# EAGLE board SOM EVAL BOARD V100 (EAGLE 9.4.1), part 1 of 3
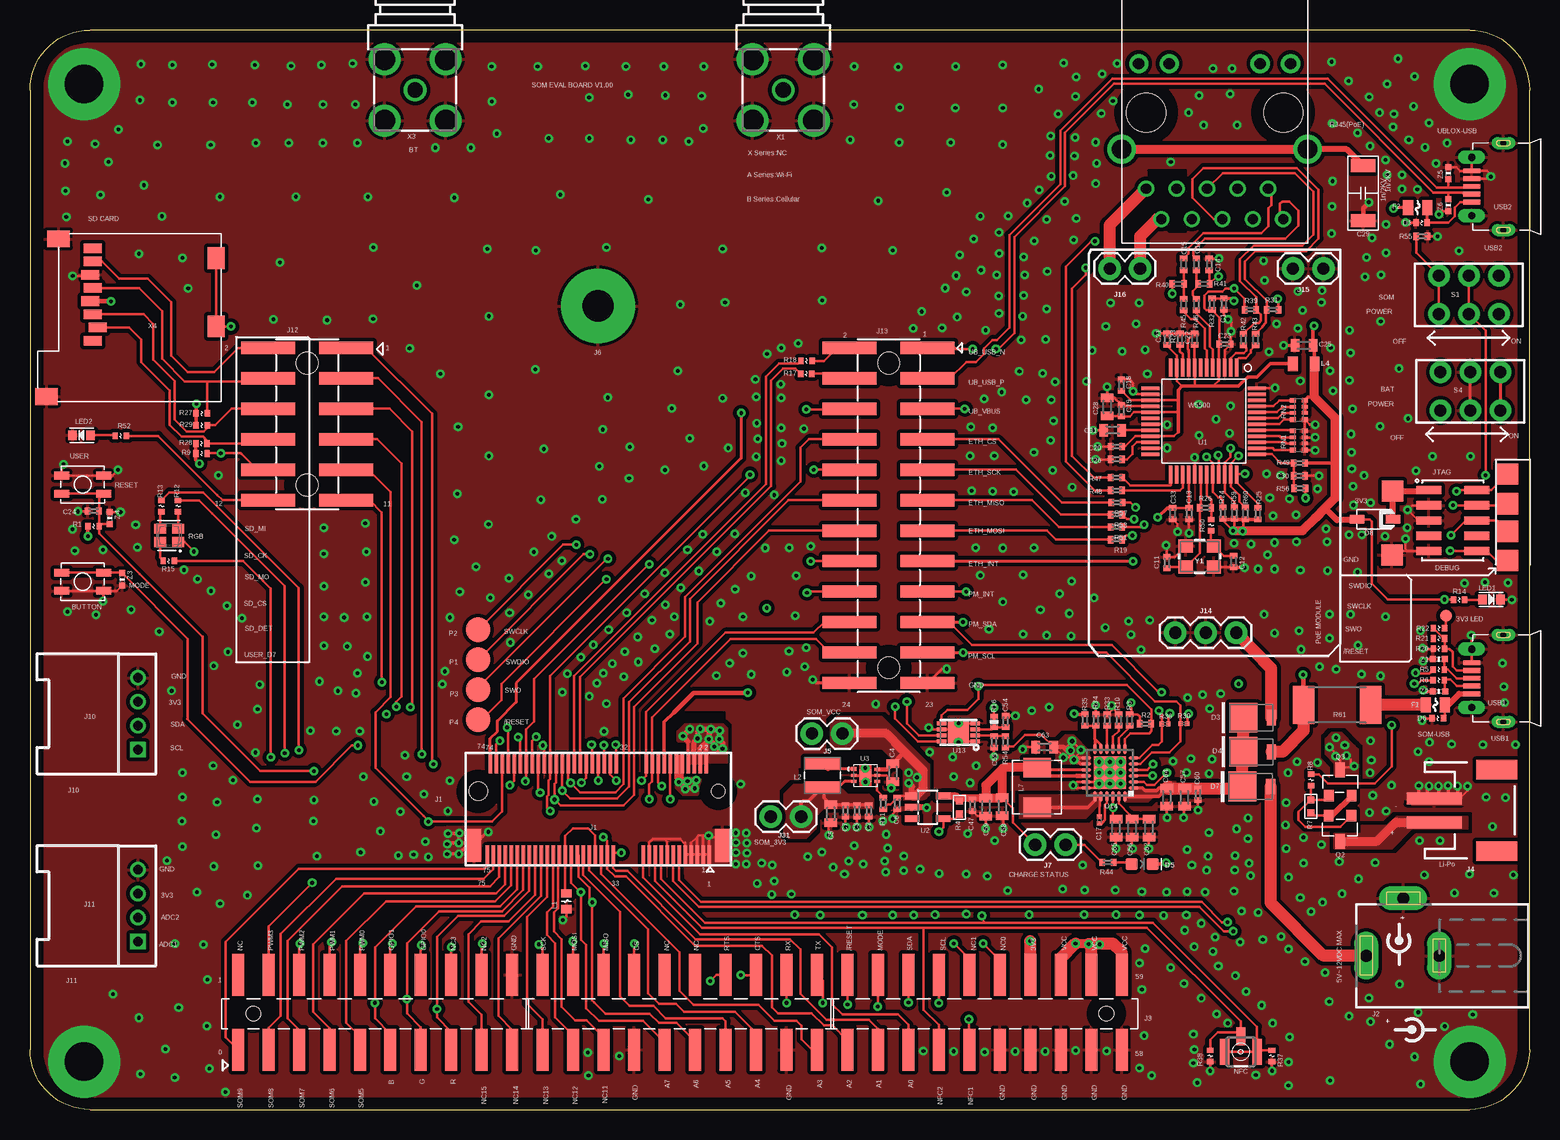
[diagram p3: board, top side]
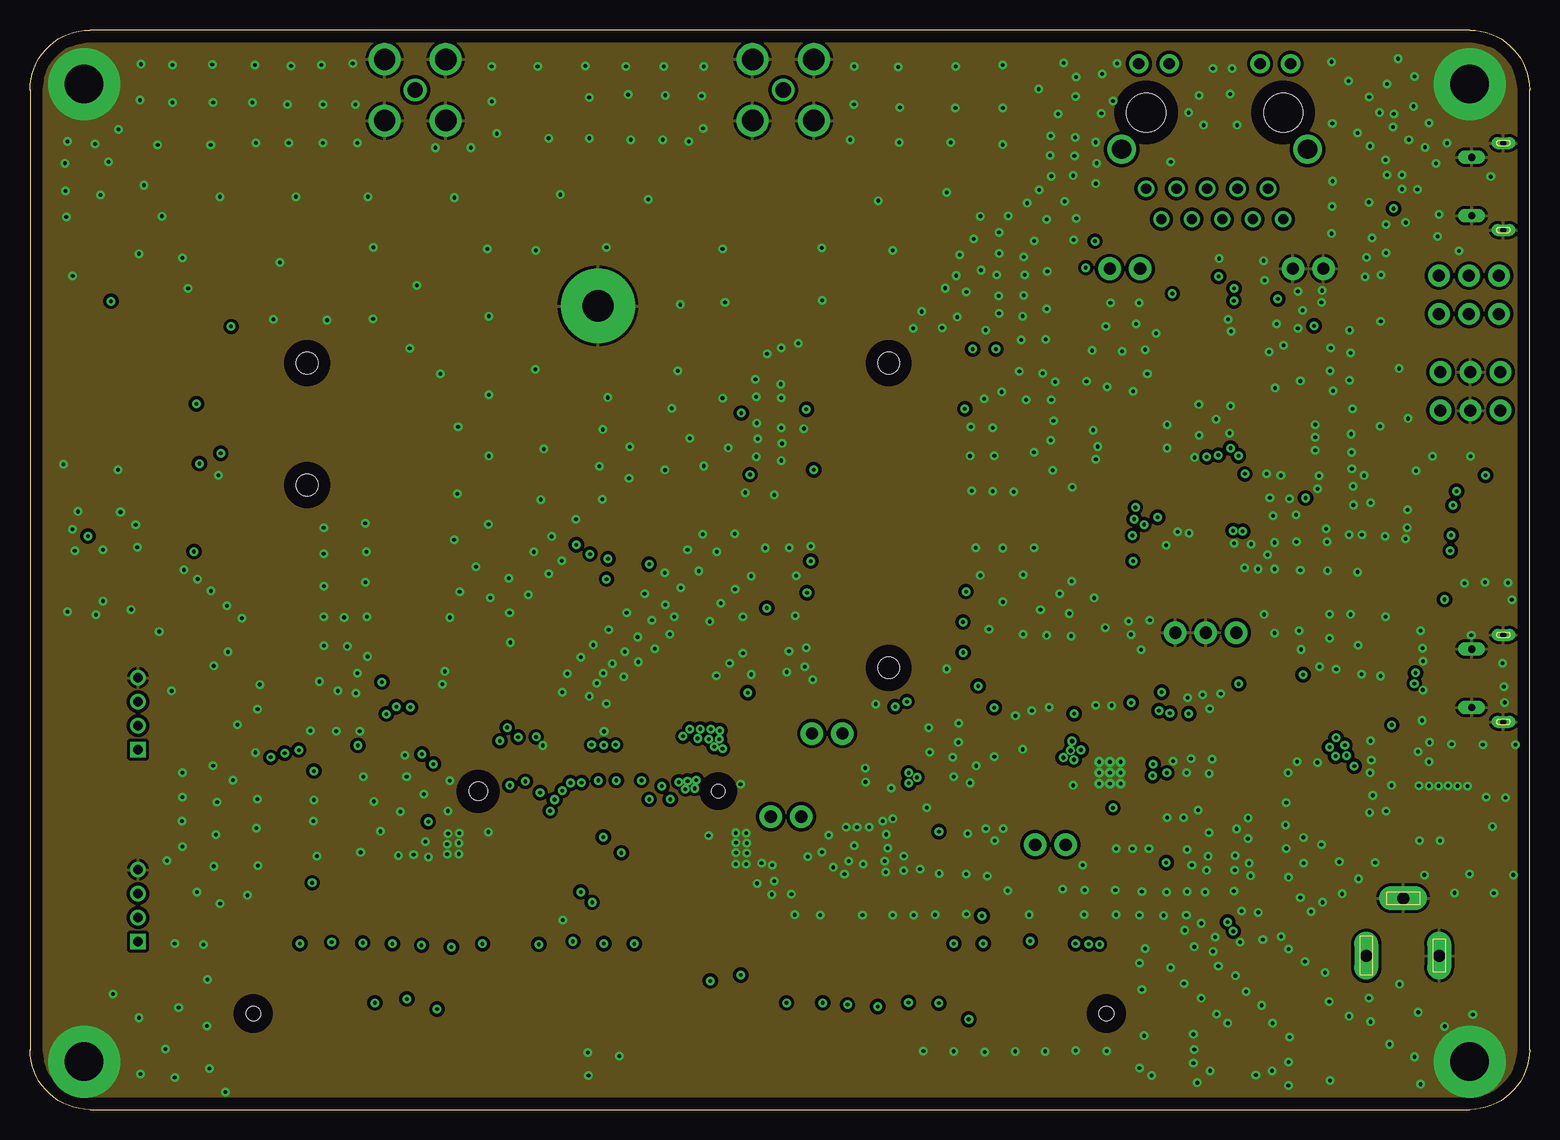
[diagram p4: board, inner layer Route2]
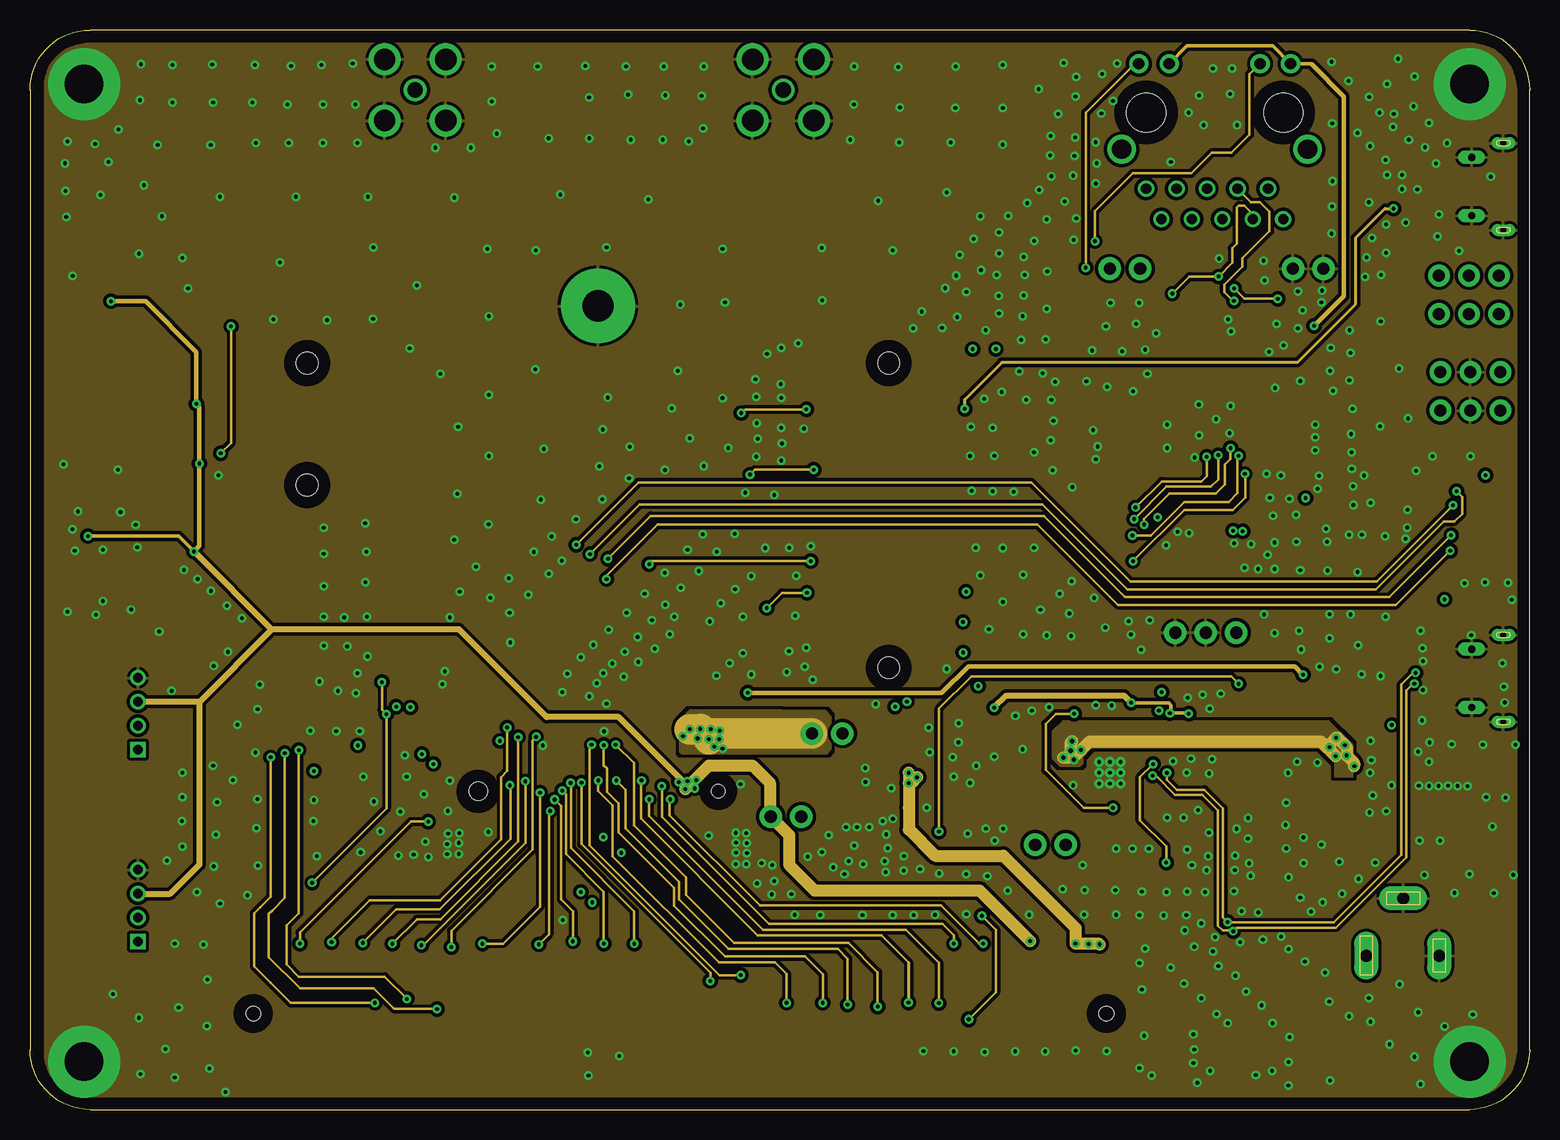
[diagram p5: board, inner layer Route15]
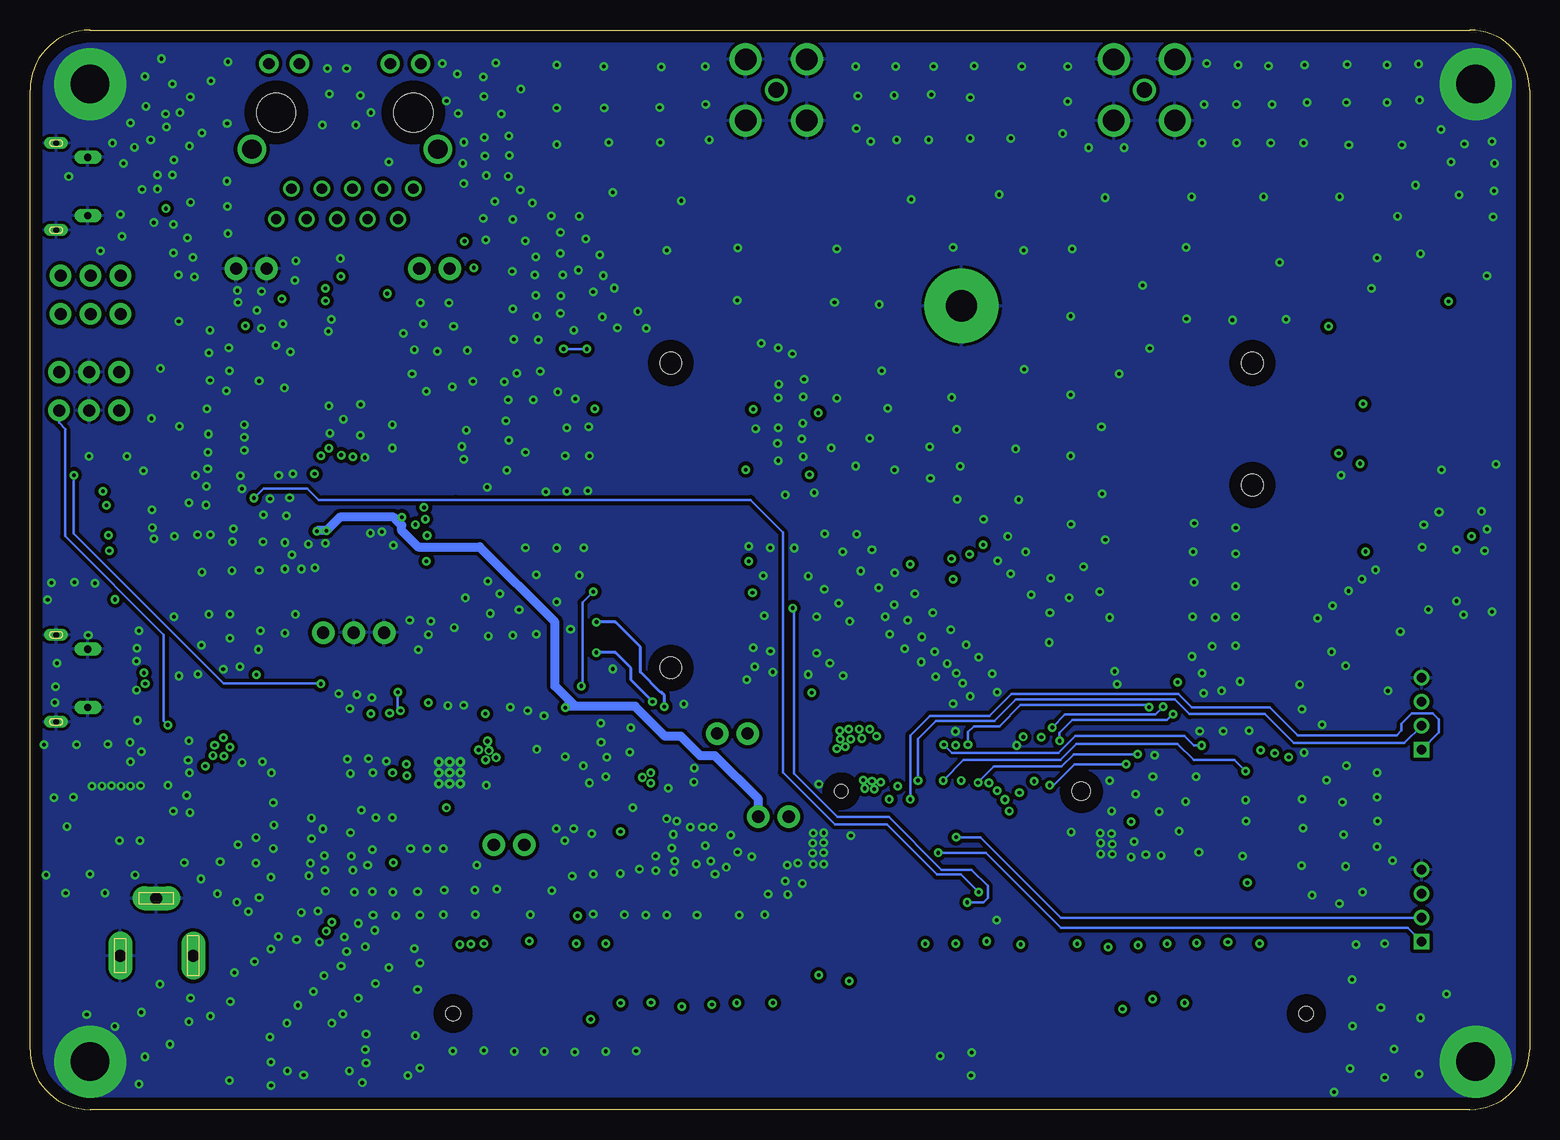
[diagram p6: board, bottom side, seen from below]

Size 125 x 90 mm. Coordinates in mm from the lower left corner, seen from the top.
Outline: 5,0 120,0 arc90 125,5 125,85 arc90 120,90 5,90 arc90 0,85 0,5 arc90 5,0
Copper layers (1+2*15+16): Top 0.035mm / dielectric 1.5mm / Route2 0.035mm / dielectric 0.15mm / Route15 0.035mm / dielectric 0.2mm / Bottom 0.035mm
Design rules "default *": minimum track width 8mil, minimum drill 12mil, track to track 8mil, track to pad 6mil, pad to pad 6mil, via to via 6mil, smd to smd 6mil, copper to edge 40mil, drill to drill 6mil, minimum pad ring 10mil, minimum via ring 8mil, stop-mask expansion 4mil, vias tented up to drill 20mil, thermal gap 10mil
Net classes: 0 default: width 0.152 mm, clearance 0.152 mm; 1 power: width 0.254 mm, drill 0.61 mm, clearance 0.203 mm; 3 BAT: clearance 0.203 mm; 4 3V3: width 0.305 mm, clearance 0.508 mm; 6 +3V3: width 0.203 mm, clearance 0.152 mm

## Footprints (pad centres in the part's own frame; a part is rotated, then mirrored left to right if it is on the bottom)
TS-1185A-020 = smd 1.27 x 0.635: 1 -1.75,0.752; 2 1.75,0.752; 3 -1.75,-0.752; 4 1.75,-0.752
C0402_B = smd 0.457 x 0.61: 1 -0.483,0; 2 0.483,0
C0603_B = smd 0.711 x 1.041: 1 -0.749,0; 2 0.749,0
C0201_B = smd 0.356 x 0.406: 1 -0.279,0; 2 0.279,0
C-1808 = smd 1.1 x 2.05: P$1 -2.285,0; P$2 2.285,0
R-0402S = smd 0.45 x 0.55: 1 -0.47,0; 2 0.47,0
DIODE-DO-220AA_NT(SMP) = smd 0.762 x 1.27: ANODE 2.349,0 | smd 2.337 x 2.464: CATHODE 0,0
LED-0603 = smd 1 x 1: A -0.877,0; C 0.877,0
SOD-123 = smd 1.2 x 0.7: 1 -1.5,0; 2 1.5,0
CON5X2_1.27 = smd 0.7 x 2.1: 1 -2.54,-2; 2 -2.54,2; 3 -1.27,-2; 4 -1.27,2; 5 0,-2; 6 0,2; 7 1.27,-2; 8 1.27,2; 9 2.54,-2; 10 2.54,2
F0805 = smd 0.85 x 1.25: P$1 -0.8,0; P$2 0.8,0
M.2EKEY = smd 0.3 x 1.55: 1 -9.62,3.735; 2 -9.37,-3.815; 3 -9.12,3.735; 4 -8.87,-3.815; 5 -8.62,3.735; 6 -8.37,-3.815; 7 -8.12,3.735; 8 -7.87,-3.815; 9 -7.62,3.735; 10 -7.37,-3.815; 11 -7.12,3.735; 12 -6.87,-3.815; 13 -6.62,3.735; 14 -6.37,-3.815; 15 -6.12,3.735; 16 -5.87,-3.815; 17 -5.62,3.735; 18 -5.37,-3.815; 19 -5.12,3.735; 20 -4.87,-3.815; 21 -4.62,3.735; 22 -4.37,-3.815; 23 -4.12,3.735; 32 -1.87,-3.815; 33 -1.62,3.735; 34 -1.37,-3.815; 35 -1.12,3.735; 36 -0.87,-3.815; 37 -0.62,3.735; 38 -0.37,-3.815; 39 -0.12,3.735; 40 0.13,-3.815; 41 0.38,3.735; 42 0.63,-3.815; 43 0.88,3.735; 44 1.13,-3.815; 45 1.38,3.735; 46 1.63,-3.815; 47 1.88,3.735; 48 2.13,-3.815; 49 2.38,3.735; 50 2.63,-3.815; 51 2.88,3.735; 52 3.13,-3.815; 53 3.38,3.735; 54 3.63,-3.815; 55 3.88,3.735; 56 4.13,-3.815; 57 4.38,3.735; 58 4.63,-3.815; 59 4.88,3.735; 60 5.13,-3.815; 61 5.38,3.735; 62 5.63,-3.815; 63 5.88,3.735; 64 6.13,-3.815; 65 6.38,3.735; 66 6.63,-3.815; 67 6.88,3.735; 68 7.13,-3.815; 69 7.38,3.735; 70 7.63,-3.815; 71 7.88,3.735; 72 8.13,-3.815; 73 8.38,3.735; 74 8.63,-3.815; 75 8.88,3.735 | smd 1.2 x 2.75: 76 9.98,2.96; 77 -10.72,2.96 | hole 1.1: -10.37,-1.54 | hole 1.55: 9.63,-1.54
DCJ0202 = drill 1 pad 2 long: 1 0,3.1; 2 4.8,0; 3 0,-3
SPARK_CON_30X2_SMD = smd 1 x 3.5: 1 0,3.013; 2 0,-3.213; 3 2.54,3.013; 4 2.54,-3.213; 5 5.08,3.013; 6 5.08,-3.213; 7 7.62,3.013; 8 7.62,-3.213; 9 10.16,3.013; 10 10.16,-3.213; 11 12.7,3.013; 12 12.7,-3.213; 13 15.24,3.013; 14 15.24,-3.213; 15 17.78,3.013; 16 17.78,-3.213; 17 20.32,3.013; 18 20.32,-3.213; 19 22.86,3.013; 20 22.86,-3.213; 21 25.4,3.013; 22 25.4,-3.213; 23 27.94,3.013; 24 27.94,-3.213; 25 30.48,3.013; 26 30.48,-3.213; 27 33.02,3.013; 28 33.02,-3.213; 29 35.56,3.013; 30 35.56,-3.213; 31 38.1,3.013; 32 38.1,-3.213; 33 40.64,3.013; 34 40.64,-3.213; 35 43.18,3.013; 36 43.18,-3.213; 37 45.72,3.013; 38 45.72,-3.213; 39 48.26,3.013; 40 48.26,-3.213; 41 50.8,3.013; 42 50.8,-3.213; 43 53.34,3.013; 44 53.34,-3.213; 45 55.88,3.013; 46 55.88,-3.213; 47 58.42,3.013; 48 58.42,-3.213; 49 60.96,3.013; 50 60.96,-3.213; 51 63.5,3.013; 52 63.5,-3.213; 53 66.04,3.013; 54 66.04,-3.213; 55 68.58,3.013; 56 68.58,-3.213; 57 71.12,3.013; 58 71.12,-3.213; 59 73.66,3.013; 60 73.66,-3.213 | hole 1.2: 1.27,0; 72.39,0
JST-2-SMD = smd 1 x 4.6: 1 -1,-3.7; 2 1,-3.7 | smd 1.6 x 3.4: NC1 -3.4,1.5; NC2 3.4,1.5
1X02 = drill 1.016 pad 1.88: 1 0,0; 2 2.54,0
SCREW-HOLE-2.6 = drill 2.6 pad 6.2: P$1 0,0
HW4-2.0-90D = drill 0.8 pad 1.27 square: 1 -3,0 | drill 0.8 pad 1.27: 2 -1,0; 3 1,0; 4 3,0
CON_6*2_SMD_HEADER = smd 1.02 x 4.5: 1 0,0.65; 2 0,-5.85; 3 2.54,0.65; 4 2.54,-5.85; 5 5.08,0.65; 6 5.08,-5.85; 7 7.62,0.65; 8 7.62,-5.85; 9 10.16,0.65; 10 10.16,-5.85; 11 12.7,0.65; 12 12.7,-5.85 | hole 1.8: 1.27,-2.6; 11.43,-2.6
1X03 = drill 1.016 pad 1.88: 1 0,0; 2 2.54,0; 3 5.08,0
CON_12*2_SMD_HEADER = smd 1.02 x 4.5: 1 0,0.65; 2 0,-5.85; 3 2.54,0.65; 4 2.54,-5.85; 5 5.08,0.65; 6 5.08,-5.85; 7 7.62,0.65; 8 7.62,-5.85; 9 10.16,0.65; 10 10.16,-5.85; 11 12.7,0.65; 12 12.7,-5.85; 13 15.24,0.65; 14 15.24,-5.85; 15 17.78,0.65; 16 17.78,-5.85; 17 20.32,0.65; 18 20.32,-5.85; 19 22.86,0.65; 20 22.86,-5.85; 21 25.4,0.65; 22 25.4,-5.85; 23 27.94,0.65; 24 27.94,-5.85 | hole 1.8: 1.27,-2.6; 26.67,-2.6
R-0603A = smd 0.7 x 0.85: 1 -0.65,0; 2 0.65,0
INDUCTOR-VLS-E = smd 1 x 3: P$1 -1,0; P$2 1,0
0805 = smd 0.8 x 1.2: 1 -0.9,0; 2 0.9,0
INDUCTOR-4040 = smd 1.65 x 2.3: P$1 -1.65,0; P$2 1.65,0
LED0603 = smd 0.7 x 0.8: 1 -0.75,0; 2 0.75,0
IPEX-20279-001E = smd 0.73 x 1.5: 1 0,1.28 | smd 0.8 x 2.2: 2@1 -1.35,0; 2@2 1.35,0
SPARK_POGO-2.0 = smd 2.032 x 2.032: P$2 0,0
SOT-23 = smd 0.8 x 0.95: 1 -0.95,-1; 2 0.95,-1 | smd 0.8 x 1.25: 3 0,1.15
R0402_B = smd 0.457 x 0.61: 1 -0.483,0; 2 0.483,0
R0603 = smd 0.6 x 0.6: 1 -0.55,0; 2 0.55,0
0402-RES = smd 0.55 x 0.6: 1 -0.4,0; 2 0.4,0
R2512 = smd 1.8 x 3.2: 1 -2.8,0; 2 2.8,0
PLCC4-2MM-RGB = smd 1 x 0.8: BLUE -0.75,-0.55; CA 0.75,-0.55; GREEN -0.75,0.55; RED 0.75,0.55
ARDUINO-ETHERNET-SHIELD2-V2_CONNETTORI_POE-RJ45 = drill 0.95 pad 1.6: 11 6.81,6.325; 12 6.81,3.785; 13 6.81,-3.785; 14 6.81,-6.325 | drill 1.6: CH1 13.94,7.75; CH2 13.94,-7.75 | drill 0.85 pad 1.3: R1 19.77,5.715; R2 17.23,4.445; R3 19.77,3.175; R4 17.23,1.905; R5 19.77,0.635; R6 17.23,-0.635; R7 19.77,-1.905; R8 17.23,-3.175; R9 19.77,-4.445; R10 17.23,-5.715 | hole 3.25: 10.89,5.715; 10.89,-5.715
4X0402ARV341 = smd 0.4 x 0.5: 1 -0.8,-0.5; 4 0.8,-0.5; 5 0.8,0.5; 8 -0.8,0.5 | smd 0.3 x 0.5: 2 -0.25,-0.5; 3 0.25,-0.5; 6 0.25,0.5; 7 -0.25,0.5
SWITCH-2.5X3.2-6 = drill 1 pad 1.8: 1 0,0; 2 0,2.5; 3 0,5; 4 3.2,0; 5 3.2,2.5; 6 3.2,5
TP = smd 1 x 1: P$1 0,0
W5500 = smd 1.5 x 0.3: 1 -4.45,2.75; 2 -4.45,2.25; 3 -4.45,1.75; 4 -4.45,1.25; 5 -4.45,0.75; 6 -4.45,0.25; 7 -4.45,-0.25; 8 -4.45,-0.75; 9 -4.45,-1.25; 10 -4.45,-1.75; 11 -4.45,-2.25; 12 -4.45,-2.75; 25 4.45,-2.75; 26 4.45,-2.25; 27 4.45,-1.75; 28 4.45,-1.25; 29 4.45,-0.75; 30 4.45,-0.25; 31 4.45,0.25; 32 4.45,0.75; 33 4.45,1.25; 34 4.45,1.75; 35 4.45,2.25; 36 4.45,2.75 | smd 0.3 x 1.5: 13 -2.75,-4.45; 14 -2.25,-4.45; 15 -1.75,-4.45; 16 -1.25,-4.45; 17 -0.75,-4.45; 18 -0.25,-4.45; 19 0.25,-4.45; 20 0.75,-4.45; 21 1.25,-4.45; 22 1.75,-4.45; 23 2.25,-4.45; 24 2.75,-4.45; 37 2.75,4.45; 38 2.25,4.45; 39 1.75,4.45; 40 1.25,4.45; 41 0.75,4.45; 42 0.25,4.45; 43 -0.25,4.45; 44 -0.75,4.45; 45 -1.25,4.45; 46 -1.75,4.45; 47 -2.25,4.45; 48 -2.75,4.45
SOT25 = smd 0.55 x 1.2: 1 -0.95,-1.3; 2 0,-1.3; 3 0.95,-1.3; 4 0.95,1.3; 5 -0.95,1.3
USP-6C = smd 0.45 x 0.35: 1 -0.975,0.55 | smd 0.45 x 0.25: 2 -0.975,0; 3 -0.975,-0.5; 4 0.975,-0.5; 5 0.975,0; 6 0.975,0.5 | smd 1.016 x 1.016: P$1 0,0
TDFN-8 = smd 0.8 x 0.3: 1 -1.4,0.75; 2 -1.4,0.25; 3 -1.4,-0.25; 4 -1.4,-0.75; 5 1.4,-0.75; 6 1.4,-0.25; 7 1.4,0.25; 8 1.4,0.75 | smd 1.73 x 1.88: EP 0,0
QFN24 = smd 0.85 x 0.28: 1 -1.975,1.25; 2 -1.975,0.75; 3 -1.975,0.25; 4 -1.975,-0.25; 5 -1.975,-0.75; 6 -1.975,-1.25; 13 1.975,-1.25; 14 1.975,-0.75; 15 1.975,-0.25; 16 1.975,0.25; 17 1.975,0.75; 18 1.975,1.25 | smd 0.28 x 0.85: 7 -1.25,-1.975; 8 -0.75,-1.975; 9 -0.25,-1.975; 10 0.25,-1.975; 11 0.75,-1.975; 12 1.25,-1.975; 19 1.25,1.975; 20 0.75,1.975; 21 0.25,1.975; 22 -0.25,1.975; 23 -0.75,1.975; 24 -1.25,1.975 | smd 2.7 x 2.7: PAD 0,0 | drill 0.3 pad 0.406: PAD@1 -0.9,0.9; PAD@2 0,0.9; PAD@3 0.9,0.9; PAD@4 -0.9,0; PAD@5 0,0; PAD@6 0.9,0; PAD@7 -0.9,-0.9; PAD@8 0,-0.9; PAD@9 0.9,-0.9
TP70_BOT = smd 1.778 x 1.778 bottom: P$1 0,0
MICRO_USB = smd 0.4 x 1.4: 1 1.3,0.1; 2 0.65,0.1; 3 0,0.1; 4 -0.65,0.1; 5 -1.3,0.1 | drill 0.6 pad 0.75 long: 6 2.425,0.1 | drill 0.5 pad 1 long: 7 3.625,2.75; 8 -3.625,2.75 | drill 0.6 pad 0.65 long: 9 -2.425,0.1
BU-SMA-G = drill 1.27: 1 0,0 | drill 1.778: 2 -2.55,2.55; 3 2.55,2.55; 4 2.55,-2.55; 5 -2.55,-2.55
SDCARD-15TW-8821 = smd 0.8 x 1.5: 1 0,0; 2 1.1,-0.4; 3 2.2,0; 4 3.3,0.2; 5 4.4,0; 6 5.5,0.2; 7 6.6,0; 8 7.7,0 | smd 1.4 x 1.9: GND1 -4.66,3.85; GND2 8.49,2.85 | smd 1.8 x 1.4: GND3 1.19,-10.3; GND4 6.89,-10.3
CRYSTAL-SMD-3.2X2.5MM = smd 1.2 x 1.1: 1 -1.175,-0.875; 2 1.175,-0.875; 3 1.175,0.875; 4 -1.175,0.875
SMD-0402MP = smd 0.5 x 0.5: 1 -0.508,0; 2 0.508,0

## Placement (x,y rotation side)
BUTTON  TS-1185A-020  [TS-1185A-020]  4.4,44 0 top
C1  0.1uF  [C0402_B]  99.52,67.13 90 top
C2  1000pF  [C0402_B]  69.93,24.89 90 top
C3  100pF  [C0402_B]  68.94,24.89 90 top
C4  10uF  [C0603_B]  71.94,28.07 270 top
C5  10uF  [C0603_B]  66.75,24.66 270 top
C6  0.1uF  [C0402_B]  72.29,25.5 90 top
C7  0.1uF  [C0402_B]  67.97,24.89 90 top
C11  18pF  [C0402_B]  94.77,45.59 270 top
C12  18pF  [C0402_B]  100.33,45.67 90 top
C13  0.1uF  [C0402_B]  96.62,49.68 90 top
C14  10nF  [C0402_B]  98.3,70.46 270 top
C15  6.8nF  [C0402_B]  96.17,70.46 90 top
C16  6.8nF  [C0402_B]  97.23,70.46 90 top
C17  47nF  [C0201_B]  89.16,24.13 90 top
C18  0.1uF  [C0402_B]  90.99,60.4 270 top
C19  0.1uF  [C0402_B]  90.99,58.27 270 top
C20  0.1uF  [C0402_B]  90.58,55.27 0 top
C21  0.1uF  [C0402_B]  94.8,64.21 270 top
C22  0.1uF  [C0402_B]  97.08,64.21 270 top
C23  0.1uF  [C0402_B]  99.62,63.81 180 top
C24  0.1uF  [C0402_B]  5.27,49.9 0 top
C25  10uF  [C0603_B]  106.2,63.7 180 top
C26  10nF  [C0402_B]  90.58,54.21 0 top
C28  10uF  [C0603_B]  89.79,58.57 90 top
C29  1n/2KV  [C-1808]  111.13,76.4 270 top
C30  0.1uF  [C0402_B]  105.82,52.83 180 top
C31  4.7uF  [C0603_B]  90.25,56.64 180 top
C33  0.1uF  [C0402_B]  95.25,49.68 90 top
C47  1nF/10V  [C0402_B]  78.56,25.35 270 top
C54  10nF  [C0402_B]  81.33,32.35 90 top
C55  1uF  [C0402_B]  80.36,30.64 270 top
C56  10uF  [C0603_B]  91.87,23.47 270 top
C57  10uF  [C0603_B]  96.23,26.03 270 top
C58  10uF  [C0603_B]  81.05,25.25 270 top
C59  10uF  [C0603_B]  79.68,25.22 270 top
C60  1uF  [C0402_B]  97.36,26.27 270 top
C62  10uF  [C0603_B]  93.27,23.47 270 top
C63  10uF  [C0603_B]  84.58,30.23 180 top
C64  10uF  [C0603_B]  94.76,26.03 270 top
C65  4.7uF  [C0603_B]  90.53,23.47 270 top
D1  ESD  [R-0402S]  116,73.94 0 top
D3  SS3P3-M3/84A  [DIODE-DO-220AA_NT(SMP)]  101.13,32.67 0 top
D4  SS3P3-M3/84A  [DIODE-DO-220AA_NT(SMP)]  101.13,29.82 0 top
D5  yellow  [LED-0603]  92.71,20.47 0 top
D6  ESD  [R-0402S]  117.35,32.62 0 top
D7  SS3P3-M3/84A  [DIODE-DO-220AA_NT(SMP)]  101.07,26.94 0 top
D8  B5819w  [SOD-123]  112.12,49.2 0 top
DEBUG  CON5X2  [CON5X2_1.27]  118.6,49.1 270 top
F1  6V 1A  [F0805]  117.15,33.73 180 top
F2  6V 1A  [F0805]  115.67,75.19 180 top
J1  TE 2199230-4  [M.2EKEY]  47,25 180 top
J2  DCJ0202  [DCJ0202]  114.48,12.82 90 top
J3  SPARK_CON_30X2_SMD  [SPARK_CON_30X2_SMD]  91,8 180 top
J4  [JST-2-SMD]  120.76,24.94 270 top
J5  [1X02]  65.18,31.35 0 top
J6  SCREW-HOLE-2.6  [SCREW-HOLE-2.6]  47.35,67 0 top
J7  [1X02]  86.34,22.07 180 top
J10  4P-2.0-90D  [HW4-2.0-90D]  9,33 90 top
J11  4P-2.0-90D  [HW4-2.0-90D]  9,17 90 top
J12  CON_62_SMD_HEADER  [CON_6*2_SMD_HEADER]  25.7,63.5 270 top
J14  [1X03]  100.55,39.75 180 top
J15  [1X02]  105.28,70.11 0 top
J16  [1X02]  90.01,70.11 0 top
J31  [1X02]  64.29,24.41 180 top
J35  CON_122_SMD_HEADER  [CON_12*2_SMD_HEADER]  74.18,63.5 270 top
L1  GZ1608D300TF  [R-0603A]  44.71,17.37 90 top
L2  NR3015T2R2M  [INDUCTOR-VLS-E]  66.04,27.86 270 top
L4  3.3µH  [0805]  106.17,62.18 180 top
L7  2.2uH  [INDUCTOR-4040]  83.94,26.86 90 top
LED1  GREEN  [LED0603]  121.82,42.52 0 top
LED2  GREEN  [LED0603]  4.3,56.21 180 top
NFC  UFL  [IPEX-20279-001E]  100.93,4.81 0 top
P1  SPARK_POGOPIN  [SPARK_POGO-2.0]  37.35,37.5 0 top
P2  SPARK_POGOPIN  [SPARK_POGO-2.0]  37.35,40 0 top
P3  SPARK_POGOPIN  [SPARK_POGO-2.0]  37.35,35 0 top
P4  SPARK_POGOPIN  [SPARK_POGO-2.0]  37.35,32.5 0 top
Q2  IR6401  [SOT-23]  109.2,23.51 180 top
Q3  IR6401  [SOT-23]  109.22,27.15 0 top
R1  ?10K  [R-0402S]  5.3,48.63 180 top
R2  10K  [R0402_B]  92.99,32.16 0 top
R3  10K  [R0402_B]  91.67,32.46 270 top
R4  100K  [R0603]  77.47,25.17 90 top
R5  0R  [R-0402S]  117.43,36.68 0 top
R6  0R  [R-0402S]  117.43,35.79 0 top
R7  100K  [R0603]  106.76,25.27 270 top
R8  1K  [R-0402S]  106.78,27.48 90 top
R9  47K  [R-0402S]  14.3,54.68 180 top
R10  10K  [R0402_B]  90.76,32.46 270 top
R11  10K  [R0402_B]  71.12,25.5 90 top
R12  1K  [R-0402S]  12.35,50.3 270 top
R13  1K  [R-0402S]  10.95,50.3 270 top
R14  1K  [R-0402S]  119.13,42.5 0 top
R15  1K  [R-0402S]  11.57,45.74 180 top
R16  150  [0402-RES]  80.37,32.32 90 top
R17  0R  [R-0402S]  64.71,61.35 180 top
R18  0R  [R-0402S]  64.74,62.41 180 top
R19  33R  [R0402_B]  90.58,47.51 180 top
R20  0R  [R-0402S]  117.45,38.41 180 top
R21  ?0R  [R-0402S]  117.45,39.27 180 top
R22  ?10K  [R-0402S]  117.45,40.13 0 top
R23  12.4k  [R0402_B]  95.86,64.21 270 top
R24  10k  [R0402_B]  99.44,49.73 270 top
R25  10k  [R0402_B]  102.36,49.68 270 top
R26  1M  [R0402_B]  98,50.17 180 top
R27  ?47K  [R-0402S]  14.32,58.03 0 top
R28  47K  [R-0402S]  14.29,55.52 0 top
R29  47K  [R-0402S]  14.32,57.05 0 top
R30  4K7  [C0201_B]  96.19,32.17 180 top
R31  49R9  [R0402_B]  103.58,66.68 0 top
R32  10R  [R0402_B]  98.53,67.13 270 top
R33  330R  [R0402_B]  89.79,32.46 90 top
R34  10K  [R0402_B]  88.85,32.46 90 top
R35  5.49K  [R0402_B]  87.94,32.46 270 top
R36  4K7  [C0201_B]  94.61,32.16 180 top
R37  ESD NC  [R-0402S]  103.52,4.47 270 top
R38  ESD NC  [R-0402S]  98.38,4.47 90 top
R39  49R9  [R0402_B]  101.73,66.68 180 top
R40  49R9  [R0402_B]  95.71,68.84 0 top
R41  49R9  [R0402_B]  97.84,68.84 180 top
R42  33R  [R0402_B]  101.15,64.19 270 top
R43  33R  [R0402_B]  102.16,64.19 270 top
R44  1K  [R0402_B]  89.84,20.6 180 top
R45  33R  [R0402_B]  96.17,67.11 270 top
R46  33R  [R0402_B]  97.23,67.11 270 top
R47  330R  [R0402_B]  90.58,52.68 0 top
R48  330R  [R0402_B]  90.58,51.61 0 top
R49  10K  [R0402_B]  105.82,53.9 0 top
R50  0R  [R-0402S]  98.45,48.72 270 top
R51  33R  [R0402_B]  90.58,48.56 180 top
R52  1K  [R-0402S]  7.57,56.16 180 top
R53  33R  [R0402_B]  90.58,49.6 180 top
R54  1K  [R0402_B]  81.31,30.66 90 top
R55  1K  [R0402_B]  116.03,72.8 0 top
R56  33R  [R0402_B]  105.84,51.79 0 top
R57  33R  [R0402_B]  90.6,50.6 180 top
R59  ?10k  [R0402_B]  100.4,49.72 270 top
R60  10k  [R0402_B]  101.32,49.71 270 top
R61  0.001Ω ±1% 3W  [R2512]  108.97,33.73 180 top
RESET  TS-1185A-020  [TS-1185A-020]  4.4,52.1 0 top
RGB  RGB-LED-CLMVB-FKARGB  [PLCC4-2MM-RGB]  11.6,47.86 0 top
RJ45  HY931147A  [ARDUINO-ETHERNET-SHIELD2-V2_CONNETTORI_POE-RJ45]  98.76,94 270 top
RN1  10k  [4X0402ARV341]  105.77,55.78 90 top
RN2  10k  [4X0402ARV341]  105.77,58.32 90 top
S1  [SWITCH-2.5X3.2-6]  122.45,66.32 90 top
S4  [SWITCH-2.5X3.2-6]  117.58,61.48 270 top
TP3  TPTP  [TP]  118.04,41.15 0 top
U1  W5500  [W5500]  97.84,57.39 270 top
U2  XC8107SOT25  [SOT25]  74.83,25.2 270 top
U3  XC9258A  [USP-6C]  69.65,27.84 0 top
U13  MAX1704X  [TDFN-8]  77.39,31.44 180 top
U14  BQ24195L  [QFN24]  90.02,28.08 180 top
U$1  TP2  [TP70_BOT]  113.59,51.56 0 bottom
U$2  TP2  [TP70_BOT]  113.54,46.23 0 bottom
U$9  TP2  [TP70_BOT]  123.17,52.99 0 bottom
U$10  TP2  [TP70_BOT]  123.17,50.5 0 bottom
U$11  TP2  [TP70_BOT]  123.17,48.21 0 bottom
U$12  TP2  [TP70_BOT]  123.17,45.77 0 bottom
USB1  MICRO_USB_5P  [MICRO_USB]  120.08,35.95 270 top
USB2  MICRO_USB_5P  [MICRO_USB]  120.08,76.95 270 top
X1  BU-SMA-G  [BU-SMA-G]  62.79,85 90 top
X3  BU-SMA-G  [BU-SMA-G]  32.11,85 90 top
X4  0046_15TW-882  [SDCARD-15TW-8821]  5.23,64.09 90 top
Y1  25MHz  [CRYSTAL-SMD-3.2X2.5MM]  97.51,46.1 180 top
Z1  PESD0402MP  [SMD-0402MP]  117.43,37.54 0 top
Z2  PESD0402MP  [SMD-0402MP]  117.45,34.85 0 top
Z3  PESD0402MP  [SMD-0402MP]  7.69,44.2 90 top
Z4  PESD0402MP  [SMD-0402MP]  6.65,49.31 270 top
Z5  PESD0402MP  [SMD-0402MP]  118.24,78.06 270 top
Z6  PESD0402MP  [SMD-0402MP]  118.24,75.39 90 top